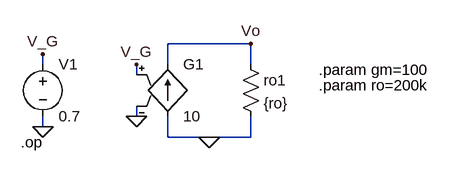
[diagram p0: schematic voltageDependentCurrentSource.asc]
voltageDependentCurrentSource.asc, the LTspice schematic file:
Version 4
SHEET 1 880 680
WIRE 192 96 64 96
WIRE -128 128 -128 112
WIRE 64 128 64 96
WIRE 192 128 192 96
WIRE 16 144 16 128
WIRE 16 208 16 192
WIRE -128 224 -128 208
WIRE 64 240 64 208
WIRE 128 240 64 240
WIRE 192 240 192 208
WIRE 192 240 128 240
FLAG 16 128 V_G
FLAG 16 208 0
FLAG -128 224 0
FLAG -128 112 V_G
FLAG 192 96 Vo
FLAG 128 240 0
SYMBOL res 176 112 R0
SYMATTR InstName ro1
SYMATTR Value {ro}
SYMBOL voltage -128 112 R0
SYMATTR InstName V1
SYMATTR Value 0.7
SYMBOL g 64 112 R0
SYMATTR InstName G1
SYMATTR Value 10
TEXT -162 248 Left 2 !.op
TEXT 296 136 Left 2 !.param gm=100
TEXT 296 160 Left 2 !.param ro=200k

The netlist it stands for:
* voltageDependentCurrentSource.asc
ro1 Vo 0 {ro}
V1 V_G 0 0.7
G1 0 Vo V_G 0 10
.op
.param gm=100
.param ro=200k
.backanno
.end